# Altium schematic sheet 按钮小板.SchDoc
size A4
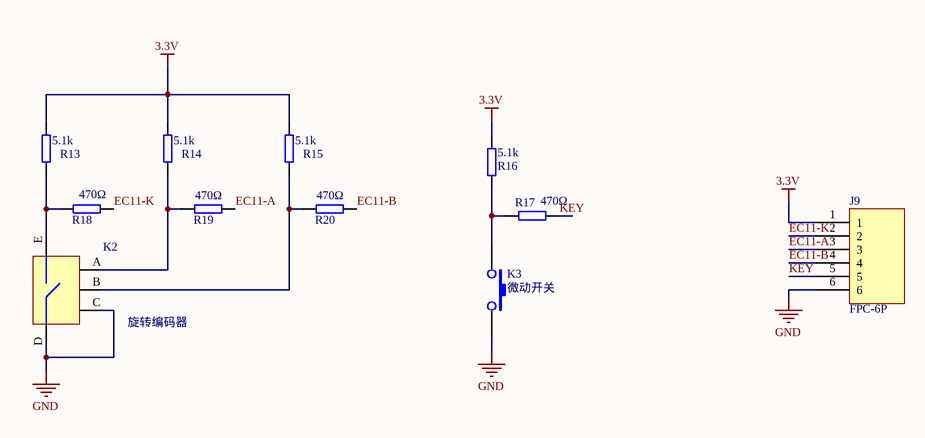
[diagram p0: 按钮小板.SchDoc]

## Parts
J9  FPC-6P  [FPC0.5-WT-6P]
K2  旋转编码器  [旋转编码器]
K3  微动开关  [轻触开关]
R13  5.1k  [0603-RES]
R14  5.1k  [0603-RES]
R15  5.1k  [0603-RES]
R16  5.1k  [0603-RES]
R17  470Ω  [0603-RES]
R18  470Ω  [0603-RES]
R19  470Ω  [0603-RES]
R20  470Ω  [0603-RES]

## Nets
3.3V: J9.1 R13.1 R14.1 R15.1 R16.2
GND: J9.6 K2.C K2.D K3.2
EC11-A: J9.3 R19.2
EC11-B: J9.4 R20.2
EC11-K: J9.2 R18.2
KEY: J9.5 R17.2
NetK2_A: K2.A R14.2 R19.1
NetK2_B: K2.B R15.2 R20.1
NetK2_E: K2.E R13.2 R18.1
NetK3_1: K3.1 R16.1 R17.1

## Library data of the parts
K2 = 选装编码器: pin to pad: C>COM
R13-R20 = 电阻